# EAGLE design motor (EAGLE 6.1)

## Sheet 1 of 2
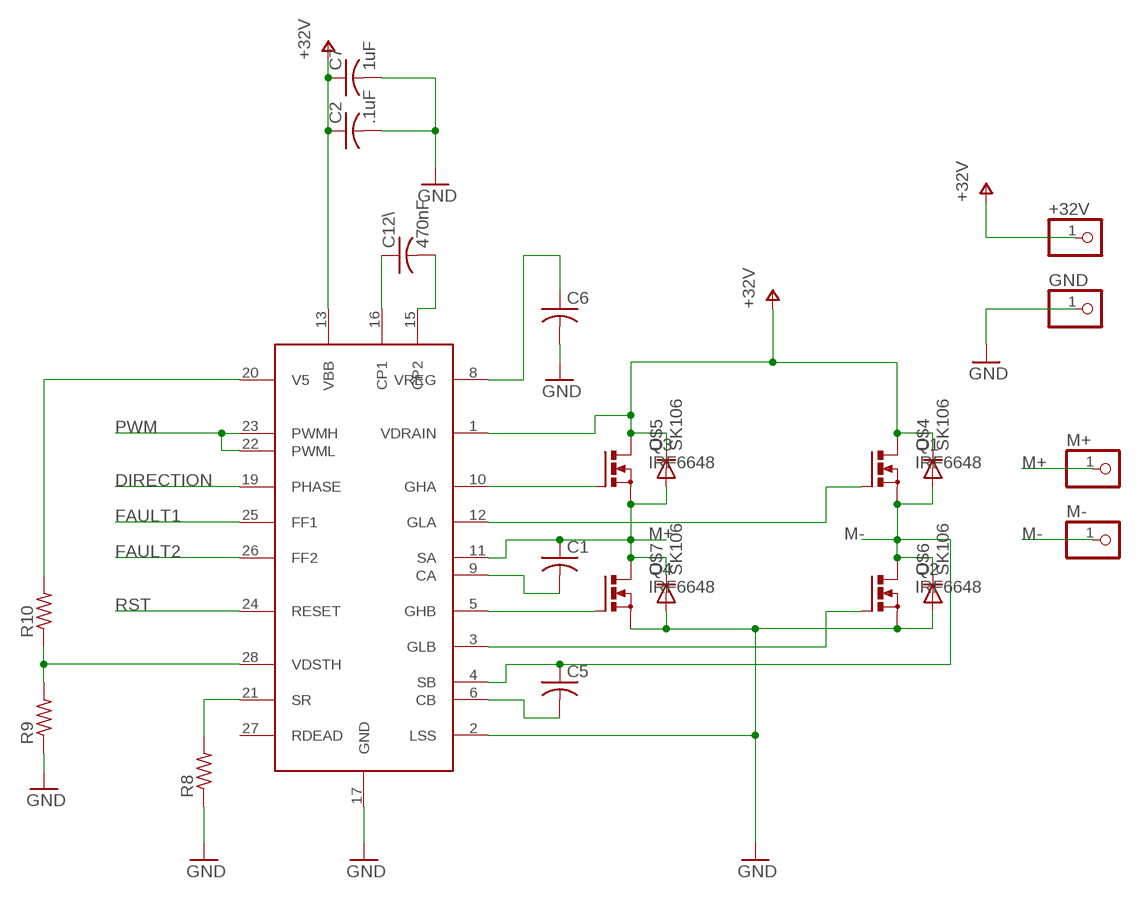
[diagram p0: schematic, sheet 1]

### Parts
+32V  PINHD-1X1  [1X01]
C1  C-USC0603  [C0603]
C2  .1uF  C-USC0603  [C0603]
C5  C-USC0603  [C0603]
C6  C-USC0603  [C0603]
C7  1uF  C-USC0603  [C0603]
C12\  470nF  C-USC0603  [C0603]
GND  PINHD-1X1  [1X01]
M+  PINHD-1X1  [1X01]
M-  PINHD-1X1  [1X01]
Q1  IRF6648  [DIRECTFET]
Q2  IRF6648  [DIRECTFET]
Q3  IRF6648  [DIRECTFET]
Q4  IRF6648  [DIRECTFET]
R8  R-US_R0603  [R0603]
R9  R-US_R0603  [R0603]
R10  R-US_R0603  [R0603]
U$1  ALLEGRO-A3921  [TSSOP28]
U$4  SK106  [DO-214AB]
U$5  SK106  [DO-214AB]
U$6  SK106  [DO-214AB]
U$7  SK106  [DO-214AB]

### Nets
+5V-A: R10.2 U$1.20(V5)
+32V: +32V.1 C2.1 C7.1 Q1.D@1(D) Q1.D@2(D) Q1.D@3(D) Q1.D@4(D) Q3.D@1(D) Q3.D@2(D) Q3.D@3(D) Q3.D@4(D) U$1.1(VDRAIN) U$1.13(VBB) U$4.P$2(C) U$5.P$2(C) ; also sheet 2
DIRECTION: U$1.19(PHASE) ; also sheet 2
FAULT1: U$1.25(FF1) ; also sheet 2
FAULT2: U$1.26(FF2) ; also sheet 2
GND: C2.2 C6.2 C7.2 GND.1 Q2.S@1(S) Q2.S@2(S) Q4.S@1(S) Q4.S@2(S) R8.1 R9.1 U$1.2(LSS) U$1.17(GND) U$6.P$1(A) U$7.P$1(A) ; also sheet 2
M+: C1.1 M+.1 Q3.S@1(S) Q3.S@2(S) Q4.D@1(D) Q4.D@2(D) Q4.D@3(D) Q4.D@4(D) U$1.11(SA) U$5.P$1(A) U$7.P$2(C)
M-: C5.1 M-.1 Q1.S@1(S) Q1.S@2(S) Q2.D@1(D) Q2.D@2(D) Q2.D@3(D) Q2.D@4(D) U$1.4(SB) U$4.P$1(A) U$6.P$2(C)
N$1: C6.1 U$1.8(VREG)
N$2: C12\.1 U$1.16(CP1)
N$3: C12\.2 U$1.15(CP2)
N$4: Q3.G U$1.10(GHA)
N$6: Q1.G U$1.12(GLA)
N$7: Q2.G U$1.3(GLB)
N$11: C5.2 U$1.6(CB)
N$12: C1.2 U$1.9(CA)
N$13: R9.2 R10.1 U$1.28(VDSTH)
N$21: Q4.G U$1.5(GHB)
N$23: R8.2 U$1.21(SR)
PWM: U$1.22(PWML) U$1.23(PWMH) ; also sheet 2
RST: U$1.24(RESET) ; also sheet 2
Unconnected: U$1.27(RDEAD)

## Sheet 2 of 2
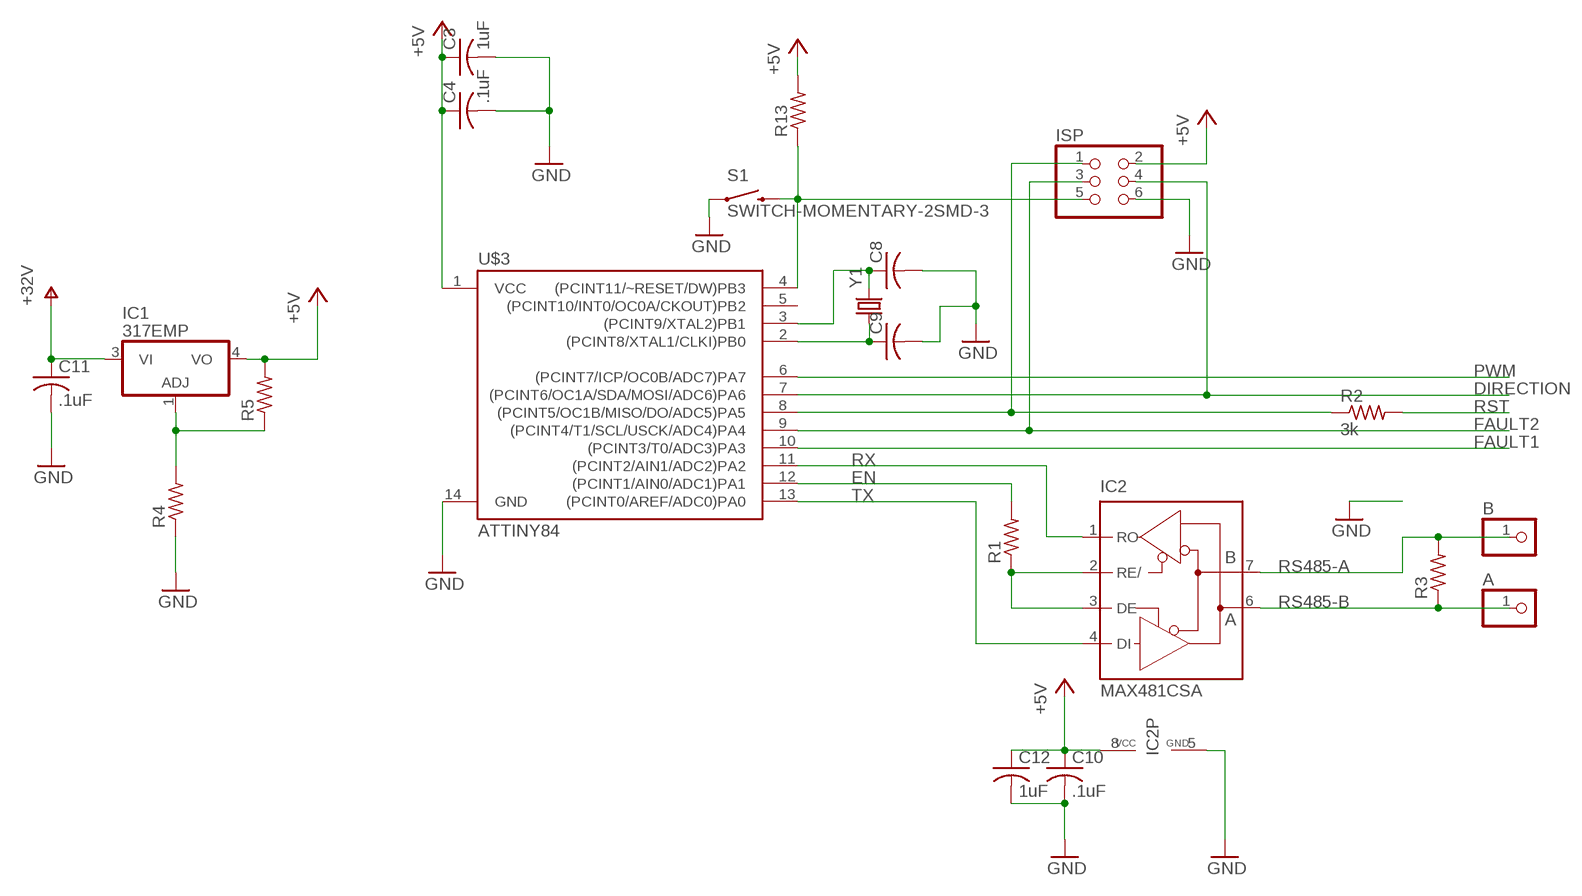
[diagram p1: schematic, sheet 2]

### Parts
A  PINHD-1X1  [1X01]
B  PINHD-1X1  [1X01]
C3  1uF  C-USC0603  [C0603]
C4  .1uF  C-USC0603  [C0603]
C8  C-USC0603  [C0603]
C9  C-USC0603  [C0603]
C10  .1uF  C-USC0603  [C0603]
C11  .1uF  C-USC0603  [C0603]
C12  1uF  C-USC0603  [C0603]
IC1  317EMP  [SOT223]
IC2  MAX481CSA  [SO08]
ISP  PINHD-2X3  [2X03]
R1  R-US_R0603  [R0603]
R2  3k  R-US_R0603  [R0603]
R3  R-US_R0603  [R0603]
R4  R-US_R0603  [R0603]
R5  R-US_R0603  [R0603]
R13  R-US_R0603  [R0603]
S1  SWITCH-MOMENTARY-2SMD-3  [TACTILE_SWITCH_SMD-3]
U$3  ATTINY84  [SO14]
Y1  CRYSTAL  [MYSMD2_RESONATOR]

### Nets
+5V: C3.1 C4.1 C10.1 C12.1 IC1.4(VO) IC2.8(VCC) ISP.2 R5.2 R13.2 U$3.1(VCC)
+32V: C11.1 IC1.3(VI) ; also sheet 1
DIRECTION: ISP.4 U$3.7((PCINT6/OC1A/SDA/MOSI/ADC6)PA6) ; also sheet 1
EN: R1.2 U$3.12((PCINT1/AIN0/ADC1)PA1)
FAULT1: U$3.10((PCINT3/T0/ADC3)PA3) ; also sheet 1
FAULT2: ISP.3 U$3.9((PCINT4/T1/SCL/USCK/ADC4)PA4) ; also sheet 1
GND: C3.2 C4.2 C8.2 C9.2 C10.2 C11.2 C12.2 IC2.5(GND) ISP.6 R4.1 S1.1 U$3.14(GND) ; also sheet 1
N$5: ISP.1 R2.1 U$3.8((PCINT5/OC1B/MISO/DO/ADC5)PA5)
N$9: ISP.5 R13.1 S1.4 U$3.4((PCINT11/~RESET/DW)PB3)
N$14: IC2.2(RE/) IC2.3(DE) R1.1
N$15: IC1.1(ADJ) R4.2 R5.1
N$16: C9.1 U$3.2((PCINT8/XTAL1/CLKI)PB0) Y1.1
N$24: C8.1 U$3.3((PCINT9/XTAL2)PB1) Y1.3
PWM: U$3.6((PCINT7/ICP/OC0B/ADC7)PA7) ; also sheet 1
RS485-A: B.1 IC2.7(B) R3.2
RS485-B: A.1 IC2.6(A) R3.1
RST: R2.2 ; also sheet 1
RX: IC2.1(RO) U$3.11((PCINT2/AIN1/ADC2)PA2)
TX: IC2.4(DI) U$3.13((PCINT0/AREF/ADC0)PA0)
Unconnected: U$3.5((PCINT10/INT0/OC0A/CKOUT)PB2)

## Library data of the parts
+32V A B GND M+ M- = pinhead:PINHD-1X1: PIN HEADER
C1-C12 C12\ = rcl:C-US: CAPACITOR, American symbol
IC1 = linear:*317: Positive VOLTAGE REGULATOR
IC2 = maxim:MAX481CSA: RS485 TRANSEIVER; MF: MAXIM; MPN: MAX481CSA; OC_FARNELL: unknown; OC_NEWARK: 90C3817
ISP = pinhead:PINHD-2X3: PIN HEADER
Q1-Q4 = transistor-power:IRF6648: DirectFET Power MOSFET Source: http://www.irf.com/product-info/datasheets/data/irf6648.pdf
R1-R5 R8-R10 R13 = rcl:R-US_: RESISTOR, American symbol
S1 = SparkFun-Electromechanical:SWITCH-MOMENTARY-2: Various NO switches- pushbuttons, reed, etc
U$1 = evan:ALLEGRO-A3921: Allegro A3921 Automotive Full Bridge Mosfet Driver
U$3 = evan:ATTINY84: Atmel 14-pin 2/4/8kB flash uC
U$4-U$7 = evan:SK106
Y1 = evan:CRYSTAL: CSTCE16M0V53-R0 Crystal

## Board
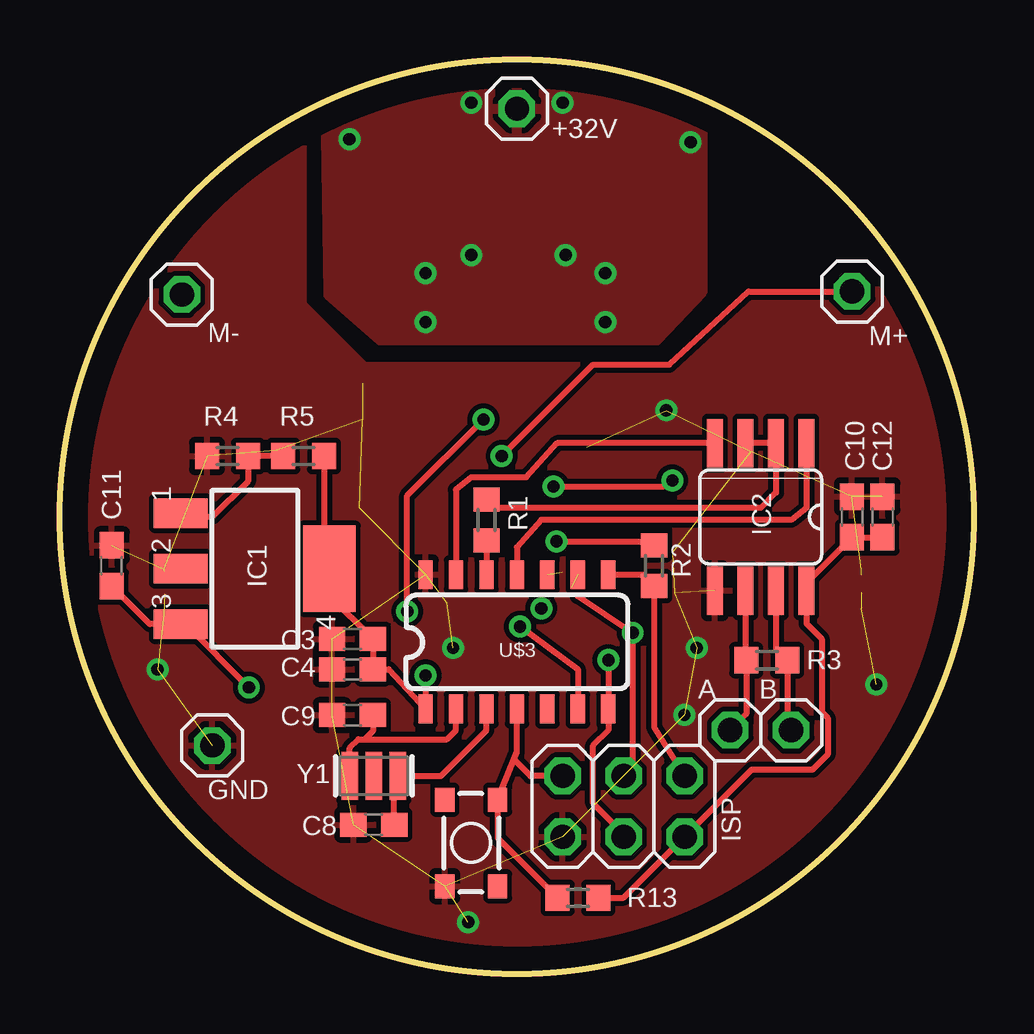
[diagram p2: board, top side]
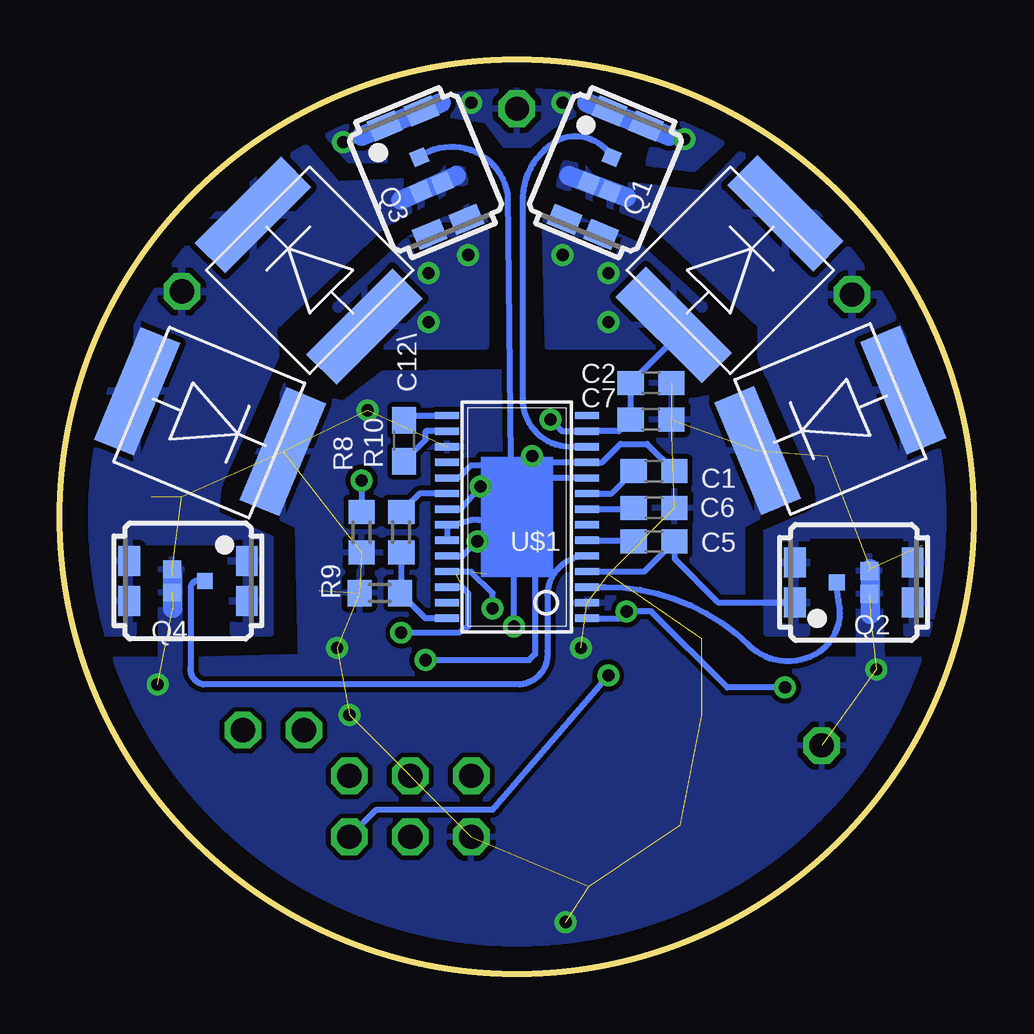
[diagram p3: board, bottom side, seen from below]

Size 38.1 x 38.1 mm. Coordinates in mm from the lower left corner, seen from the top.
Outline: circle at 19.05,19.05 radius 19.05
Copper layers (1*16): Top 0.035mm / dielectric 1.5mm / Bottom 0.035mm
Design rules: minimum track width 10mil, minimum drill 24mil, track to track 8mil, track to pad 8mil, pad to pad 8mil, via to via 8mil, smd to smd 8mil, copper to edge 40mil, drill to drill 8mil, minimum pad ring 10mil, minimum via ring 8mil, stop-mask expansion 4mil, vias tented up to drill 0mil, thermal gap 10mil

### Footprints (pad centres in the part's own frame; a part is rotated, then mirrored left to right if it is on the bottom)
1X01 = drill 1.016 octagon: 1 0,0
C0603 = smd 1.1 x 1: 1 -0.85,0; 2 0.85,0
SOT223 = smd 1.219 x 2.235: 1 -2.311,-3.099; 2 0,-3.099; 3 2.311,-3.099 | smd 3.6 x 2.2: 4 0,3.099
SO08 = smd 0.66 x 2.032: 1 -1.905,-3.073; 2 -0.635,-3.073; 3 0.635,-3.073; 4 1.905,-3.073; 5 1.905,3.073; 6 0.635,3.073; 7 -0.635,3.073; 8 -1.905,3.073
2X03 = drill 1.016 octagon: 1 -2.54,-1.27; 2 -2.54,1.27; 3 0,-1.27; 4 0,1.27; 5 2.54,-1.27; 6 2.54,1.27
DIRECTFET = smd 0.9 x 1.25: D@1 -2.45,0.825; D@2 -2.45,-0.825; D@3 2.45,0.825; D@4 2.45,-0.825 | smd 0.65 x 0.65: G -0.7,0 | smd 0.75 x 0.75: S@1 0.65,0.475; S@2 0.65,-0.475
R0603 = smd 1 x 1.1: 1 -0.85,0; 2 0.85,0
TACTILE_SWITCH_SMD-3 = smd 1 x 0.8: 1 -1.8,1.1; 2 1.8,1.1; 3 -1.8,-1.1; 4 1.8,-1.1
TSSOP28 = smd 0.305 x 0.991: 1 -4.225,-2.918; 2 -3.575,-2.918; 3 -2.925,-2.918; 4 -2.275,-2.918; 5 -1.625,-2.918; 6 -0.975,-2.918; 7 -0.325,-2.918; 8 0.325,-2.918; 9 0.975,-2.918; 10 1.625,-2.918; 11 2.275,-2.918; 12 2.925,-2.918; 13 3.575,-2.918; 14 4.225,-2.918; 15 4.225,2.918; 16 3.575,2.918; 17 2.925,2.918; 18 2.275,2.918; 19 1.625,2.918; 20 0.975,2.918; 21 0.325,2.918; 22 -0.325,2.918; 23 -0.975,2.918; 24 -1.625,2.918; 25 -2.275,2.918; 26 -2.925,2.918; 27 -3.575,2.918; 28 -4.225,2.918
SO14 = smd 0.6 x 1.2: 1 -3.81,-2.8; 2 -2.54,-2.8; 3 -1.27,-2.8; 4 0,-2.8; 5 1.27,-2.8; 6 2.54,-2.8; 7 3.81,-2.8; 8 3.81,2.8; 9 2.54,2.8; 10 1.27,2.8; 11 0,2.8; 12 -1.27,2.8; 13 -2.54,2.8; 14 -3.81,2.8
DO-214AB = smd 1.778 x 5.08: P$1 3.302,0.051; P$2 -3.277,0.051
MYSMD2_RESONATOR = smd 0.7 x 2: 1 -1,0; 2 0,0; 3 1,0

### Placement (x,y rotation side)
+32V  19.05,36.07 0 top
A  27.94,10.16 0 top
B  30.48,10.16 0 top
C1  13.34,20.96 180 bottom
C2  13.46,24.64 0 bottom
C3  12.19,13.97 180 top
C4  12.19,12.7 180 top
C5  13.34,18.03 180 bottom
C6  13.34,19.43 0 bottom
C7  13.46,23.11 0 bottom
C8  13.08,6.22 180 top
C9  12.19,10.79 180 top
C10  33.02,19.05 90 top
C11  2.16,17.02 90 top
C12  34.29,19.05 90 top
C12\  23.75,22.23 90 bottom
GND  6.35,9.53 0 top
IC1  8.13,16.89 270 top
IC2  29.21,19.05 180 top
ISP  23.5,6.99 180 top
M+  33.02,28.45 0 top
M-  5.08,28.32 0 top
Q1  15.37,33.4 247.5 bottom
Q2  5.02,16.32 0 bottom
Q3  22.86,33.4 292.5 bottom
Q4  32.77,16.38 180 bottom
R1  17.78,18.92 270 top
R2  24.77,17.02 90 top
R3  29.46,13.08 0 top
R4  6.99,21.59 0 top
R5  10.16,21.59 0 top
R8  25.53,18.41 90 bottom
R9  24.77,15.88 0 bottom
R10  23.88,18.41 90 bottom
R13  21.59,3.18 0 top
S1  17.14,5.46 90 top
U$1  19.05,19.05 90 bottom
U$3  19.05,13.84 0 top
U$4  10.16,29.34 45 bottom
U$5  27.69,29.34 135 bottom
U$6  5.99,23.13 202.5 bottom
U$7  31.88,22.99 337.5 bottom
Y1  13.08,8.26 0 top

### Tracks (layer width: path | path; a pad name or v marks a point on that pad's centre or on a via)
+5V  (via drill 0.51)
  Top 0.254: v15.24,12.45 U$3.1 13.71,12.7 C4.1 C3.1 11.23,15.79 IC1.4 11.01,17.11 R5.2 | R13.2 23.5,3.18 ISP.2 28.83,8.51 31.37,8.51 32,9.14 32,10.67 31.75,10.92 31.75,13.97 31.12,14.61 IC2.8 31.12,16.3 C10.1 C12.1
  Bottom 0.254: v15.24,12.45 19.94,6.99 20.07,6.86 24.89,6.86 ISP.2
+5V-A
  Bottom 0.254: U$1.20 23.12,20.03 R10.2
+32V  (via drill 0.51)
  Top 0.254: C11.1 3.75,14.58 IC1.3 5.23,14.58 v7.87,11.94 | v14.48,15.11 14.48,19.94 v17.65,23.11
  Bottom 0.254: U$1.1 14.77,14.83 v14.48,15.11 13.46,15.11 10.29,11.94 v7.87,11.94 | v17.65,23.11 17.16,22.62 U$1.13 14.8,22.62 C7.1 C2.1 12.51,26.44 U$4.P$2
  other vias: 15.24,29.21 17.14,29.97 15.24,27.18 21.08,29.97 22.73,29.21 22.73,27.18 12.07,34.8 26.29,34.67 17.14,36.32 20.96,36.32
  pour Bottom: 11.18,27.81 13.97,30.35 17.78,32 17.91,31.12 17.78,26.16 12.7,26.16
  pour Bottom (isolate 0.61): 20.83,32.13 23.62,30.61 26.67,27.81 25.15,26.16 20.32,26.16 20.32,31.24 20.7,32.13
  pour Top: 13.34,26.42 24.89,26.42 26.8,28.45 26.8,36.32 24.26,37.21 20.96,37.85 17.27,37.85 14.48,37.47 11.05,36.32 11.18,28.32
  pour Bottom: 9.65,35.43 11.68,33.53 13.59,33.78 13.34,34.67 16.38,35.94 17.65,35.31 18.54,34.54 19.56,34.54 20.32,35.56 22.1,35.81 24.89,34.67 24.51,33.91 26.04,33.91 27.81,35.94 26.04,36.7 23.37,37.59 20.57,37.97 19.05,38.1 17.27,37.97 15.24,37.72 12.57,36.96
DIRECTION  (via drill 0.51)
  Top 0.254: v22.86,13.08 U$3.7 22.86,10.16 22.23,9.53 22.23,7.11 23.5,5.84 ISP.4
  Bottom 0.254: U$1.19 21.49,20.68 20.96,21.21 20.32,21.21 18.29,19.3 18.29,13.34 18.54,13.08 v22.86,13.08
EN
  Top 0.254: R1.2 U$3.12
FAULT1  (via drill 0.51)  (1 unrouted)
  Top 0.254: 20.32,15.49 v20.07,15.24
  Bottom 0.254: v20.07,15.24 20.07,15.88 20.96,16.76 21.96,16.76 U$1.25
FAULT2  (via drill 0.51)  (1 unrouted)
  Top 0.254: 21.59,15.75 v23.88,14.22 23.88,8.64 ISP.3
  Bottom 0.254: U$1.26 21.33,16.12 21.08,15.88 21.08,14.48 21.46,14.22 v23.88,14.22
GND  (via drill 0.51)  (34 unrouted)
  Bottom 0.813: 33.4,16.64 33.4,15.24 | 4.32,16.89 4.32,14.99
  other vias: 25.27,23.5 4.06,12.7 34.04,12.07 16.38,13.59 26.54,13.59 17.02,2.16 26.04,10.79
  pour Top: 38.1,19.05 arc-90 19.05,0 arc-90 0,19.05 arc-62 10.16,35.81 10.16,27.94 12.7,25.4 25.4,25.4 27.94,27.94 27.94,35.94 28.58,35.56 arc-58
  pour Bottom: 37.21,13.08 36.7,11.94 arc-137 1.27,12.32 arc-5 1.02,13.08 3.81,13.08 3.94,17.4 4.83,17.4 4.83,13.08 9.65,13.08 9.65,18.67 7.37,19.94 9.27,24.38 11.68,23.88 13.46,25.15 24.64,25.02 26.29,23.75 28.7,24.51 30.61,19.81 28.19,18.67 28.07,13.21 32.89,13.08 33.02,17.27 33.91,17.27 33.91,13.08
M+  (via drill 0.51)
  Top 0.254: v18.41,21.59 22.23,25.4 25.4,25.4 28.7,28.45 M+.1
  Bottom 0.254: C1.1 13.63,22.1 14.73,22.1 15.51,21.32 U$1.11 18.15,21.32 v18.41,21.59
  Bottom 0.813: 21.59,33.27 23.88,32.26
  pour Bottom (isolate 0.61): 21.21,33.02 24.64,31.24 29.21,26.92 29.08,25.78 31.5,20.32 31.62,19.18 29.34,18.16 29.34,14.22 30.86,14.22 30.99,18.03 34.92,18.03 35.05,14.22 37.47,14.22 37.72,15.11 37.85,16.51 37.97,18.16 38.1,19.56 37.97,20.96 37.72,22.61 37.34,24.51 36.7,26.29 35.94,27.94 35.18,29.21 34.29,30.48 33.27,31.75 32.39,32.64 31.24,33.66 29.72,34.8 28.7,35.43 26.54,32.89 23.62,33.02 21.46,33.91
M-
  Bottom 0.254: U$1.4 13.74,16.78 C5.1 12.48,17.31 10.67,15.49 7.34,15.49 Q2.D@2
  Bottom 0.813: 16.89,33.27 14.48,32.39
  pour Bottom (isolate 0.61): 16.51,33.66 14.61,32.89 11.3,32.51 8.89,35.05 8.38,34.8 6.35,33.27 5.33,32.26 4.32,31.12 3.56,30.1 2.67,28.83 1.91,27.43 1.27,25.91 0.76,24.38 0.38,22.61 0,20.45 0,18.29 0.13,16.38 0.51,14.61 0.76,14.22 2.79,14.22 2.79,18.29 6.99,18.29 6.99,14.22 8.64,14.22 8.64,18.54 6.48,19.43 6.48,20.32 8.89,25.65 8.89,27.05 13.46,31.37 17.27,32.89 17.02,33.78
N$1
  Bottom 0.254: U$1.8 14.19,19.38 C6.1
N$2
  Bottom 0.254: C12\.1 22.86,22.26 22.86,22.61 22.84,22.62 U$1.16
N$3
  Bottom 0.254: C12\.2 23.42,23.27 U$1.15
N$4
  Bottom 0.254: U$1.10 18.26,20.68 arc90 19.3,21.46 19.43,32.51 arc-115 Q3.G
N$5
  Top 0.254: U$3.8 24.29,16.64 R2.1 24.77,10.29 ISP.1
N$6
  Bottom 0.254: U$1.12 16.89,21.98 arc90 18.8,24 18.8,32.39 arc60 17.27,34.8 arc82 Q1.G
N$7
  Bottom 0.254: U$1.3 15.37,16.13 arc45 9.4,13.72 arc-73 6.6,13.34 arc-66 5.59,15.24 arc10 Q2.G
N$9
  Top 0.254: 18.93,8.94 S1.4 18.25,5.67 R13.1 | 18.93,8.94 19.05,9.25 U$3.4 | ISP.5 19.61,8.26 18.93,8.94
N$10
  Bottom 0.813: 12.7,34.92 16.13,36.32
N$11
  Bottom 0.254: U$1.6 14.19,18.07 C5.2
N$12
  Bottom 0.254: U$1.9 15.12,20.03 C1.2
N$13
  Bottom 0.254: U$1.28 22.87,14.83 R9.2 23.88,15.91 R10.1
N$14
  Top 0.254: IC2.3 IC2.2 29.84,20.07 29.21,19.43 18.25,19.43 R1.1
N$15
  Top 0.254: R5.1 R4.2 7.84,20.54 6.35,19.05 5.18,19.05 IC1.1
N$16
  Top 0.254: Y1.1 12.08,9.41 12.45,9.78 12.7,9.78 | 12.7,9.78 16.13,9.78 16.51,10.16 U$3.2 | C9.1 13.04,10.12 12.7,9.78
N$17
  Bottom 0.813: 25.53,34.92 22.23,36.32
N$21
  Bottom 0.254: U$1.5 arc-90 17.78,15.78 17.78,13.46 arc90 18.92,12.07 32.13,12.07 arc90 32.64,12.83 32.64,16.19 arc90 Q4.G
N$23  (via drill 0.51)
  Top 0.254: v20.57,20.32 25.15,20.32 v25.53,20.57
  Bottom 0.254: U$1.21 21.39,19.38 v20.57,20.32 | v25.53,20.57 R8.2
N$24
  Top 0.254: U$3.3 17.78,10.16 15.88,8.26 Y1.3 13.93,8.11 C8.1
PWM  (via drill 0.51)
  Top 0.254: v19.18,14.48 21.59,12.7 U$3.6
  Bottom 0.254: U$1.23 U$1.22 21.91,18.67 20.96,18.92 arc90 19.18,17.4 v19.18,14.48
RS485-A
  Top 0.254: IC2.7 29.84,13.55 R3.2 30.31,10.33 B.1
RS485-B
  Top 0.254: IC2.6 28.58,13.12 R3.1 28.61,10.83 A.1
RST  (via drill 0.51)
  Top 0.254: v20.7,18.03 24.6,18.03 R2.2
  Bottom 0.254: U$1.24 21.31,17.43 v20.7,18.03
RX
  Top 0.254: IC2.1 31.12,19.43 30.48,18.92 20.07,18.92 19.05,17.78 U$3.11
TX
  Top 0.254: IC2.4 20.73,22.12 19.43,20.7 17.14,20.7 16.51,20.19 U$3.13

### Text on the board
_tsilk: Evan Widloski | Purdue IEEE ROV | 2014-06-11 v1 | RS485